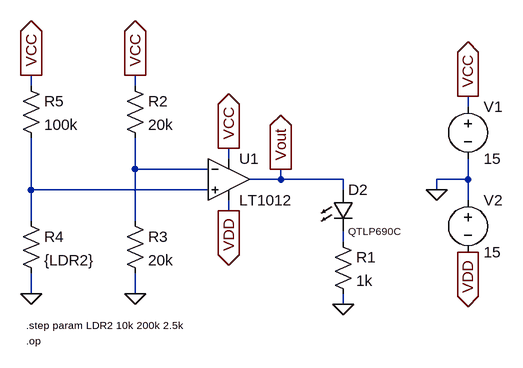
[diagram p0: schematic Light_Control_LDR_ OPAMP.asc]
Light_Control_LDR_ OPAMP.asc, the LTspice schematic file:
Version 4
SHEET 1 880 680
WIRE -144 0 -144 -16
WIRE 16 0 16 -16
WIRE 528 32 528 16
WIRE 160 112 160 96
WIRE 16 128 16 80
WIRE 128 128 16 128
WIRE 240 144 240 128
WIRE 240 144 192 144
WIRE 336 144 240 144
WIRE 528 144 528 112
WIRE 528 144 480 144
WIRE -144 160 -144 80
WIRE 128 160 -144 160
WIRE 336 160 336 144
WIRE 480 160 480 144
WIRE 528 176 528 144
WIRE 160 192 160 176
WIRE -144 208 -144 160
WIRE 16 208 16 128
WIRE 336 240 336 224
WIRE -144 320 -144 288
WIRE 16 320 16 288
WIRE 336 336 336 320
FLAG 480 160 0
FLAG 528 16 VCC
IOPIN 528 16 Out
FLAG 528 256 VDD
IOPIN 528 256 Out
FLAG 160 96 VCC
IOPIN 160 96 Out
FLAG 160 192 VDD
IOPIN 160 192 Out
FLAG 240 128 Vout
IOPIN 240 128 Out
FLAG 16 320 0
FLAG 16 -16 VCC
IOPIN 16 -16 Out
FLAG 336 336 0
FLAG -144 320 0
FLAG -144 -16 VCC
IOPIN -144 -16 Out
SYMBOL Opamps\\LT1012 160 80 R0
SYMATTR InstName U1
SYMBOL voltage 528 16 R0
SYMATTR InstName V1
SYMATTR Value 15
SYMBOL voltage 528 160 R0
SYMATTR InstName V2
SYMATTR Value 15
SYMBOL res 0 192 R0
SYMATTR InstName R3
SYMATTR Value 20k
SYMBOL res 0 -16 R0
SYMATTR InstName R2
SYMATTR Value 20k
SYMBOL LED 320 160 R0
WINDOW 3 24 64 Left 1
SYMATTR Value QTLP690C
SYMATTR InstName D2
SYMATTR Description Diode
SYMATTR Type diode
SYMBOL res 320 224 R0
SYMATTR InstName R1
SYMATTR Value 1k
SYMBOL res -160 192 R0
SYMATTR InstName R4
SYMATTR Value {LDR2}
SYMBOL res -160 -16 R0
SYMATTR InstName R5
SYMATTR Value 100k
TEXT -152 368 Left 1 !.step param LDR2 10k 200k 2.5k
TEXT -152 392 Left 1 !.op

The netlist it stands for:
* Light_Control_LDR_ OPAMP.asc
XU1 N002 N001 VCC VDD Vout LT1012  ; pins In+ In- V+ V- OUT
V1 VCC 0 15
V2 0 VDD 15
R3 N001 0 20k
R2 VCC N001 20k
D2 Vout N003 QTLP690C
R1 N003 0 1k
R4 N002 0 {LDR2}
R5 VCC N002 100k
.model D D
.lib standard.dio
.step param LDR2 10k 200k 2.5k
.op
.backanno
.end